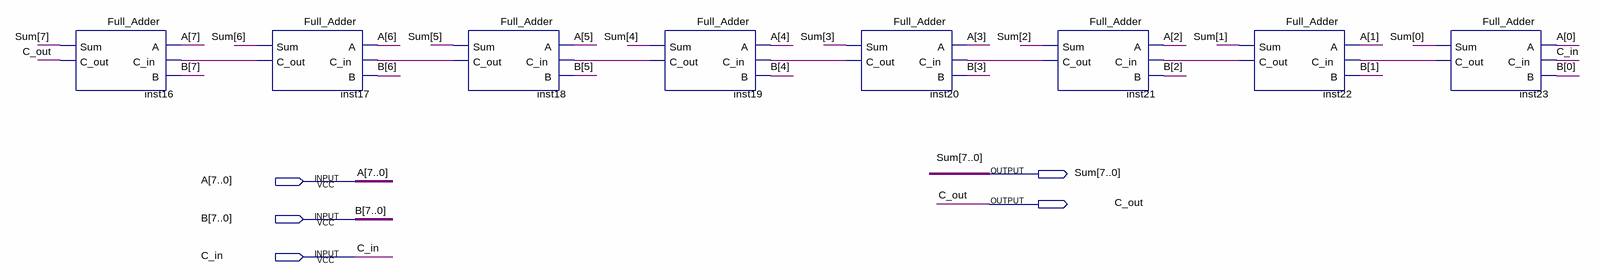
[diagram p0: schematic sheet]
// Quartus schematic Full_Adder_8bit.bdf as structural Verilog: 8 symbols, 5 pins
module Full_Adder_8bit (
  input  [7:0] A,
  input  [7:0] B,
  input  C_in,
  output [7:0] Sum,
  output C_out
);

  wire inst17_c_out, inst18_c_out, inst19_c_out, inst20_c_out, inst21_c_out, inst22_c_out, inst23_c_out;

  Full_Adder inst16 (.A(A[7]), .C_in(inst17_c_out), .B(B[7]), .Sum(Sum[7]), .C_out(C_out));
  Full_Adder inst17 (.A(A[6]), .C_in(inst18_c_out), .B(B[6]), .Sum(Sum[6]), .C_out(inst17_c_out));
  Full_Adder inst18 (.A(A[5]), .C_in(inst19_c_out), .B(B[5]), .Sum(Sum[5]), .C_out(inst18_c_out));
  Full_Adder inst19 (.A(A[4]), .C_in(inst20_c_out), .B(B[4]), .Sum(Sum[4]), .C_out(inst19_c_out));
  Full_Adder inst20 (.A(A[3]), .C_in(inst21_c_out), .B(B[3]), .Sum(Sum[3]), .C_out(inst20_c_out));
  Full_Adder inst21 (.A(A[2]), .C_in(inst22_c_out), .B(B[2]), .Sum(Sum[2]), .C_out(inst21_c_out));
  Full_Adder inst22 (.A(A[1]), .C_in(inst23_c_out), .B(B[1]), .Sum(Sum[1]), .C_out(inst22_c_out));
  Full_Adder inst23 (.A(A[0]), .C_in(C_in), .B(B[0]), .Sum(Sum[0]), .C_out(inst23_c_out));
endmodule
